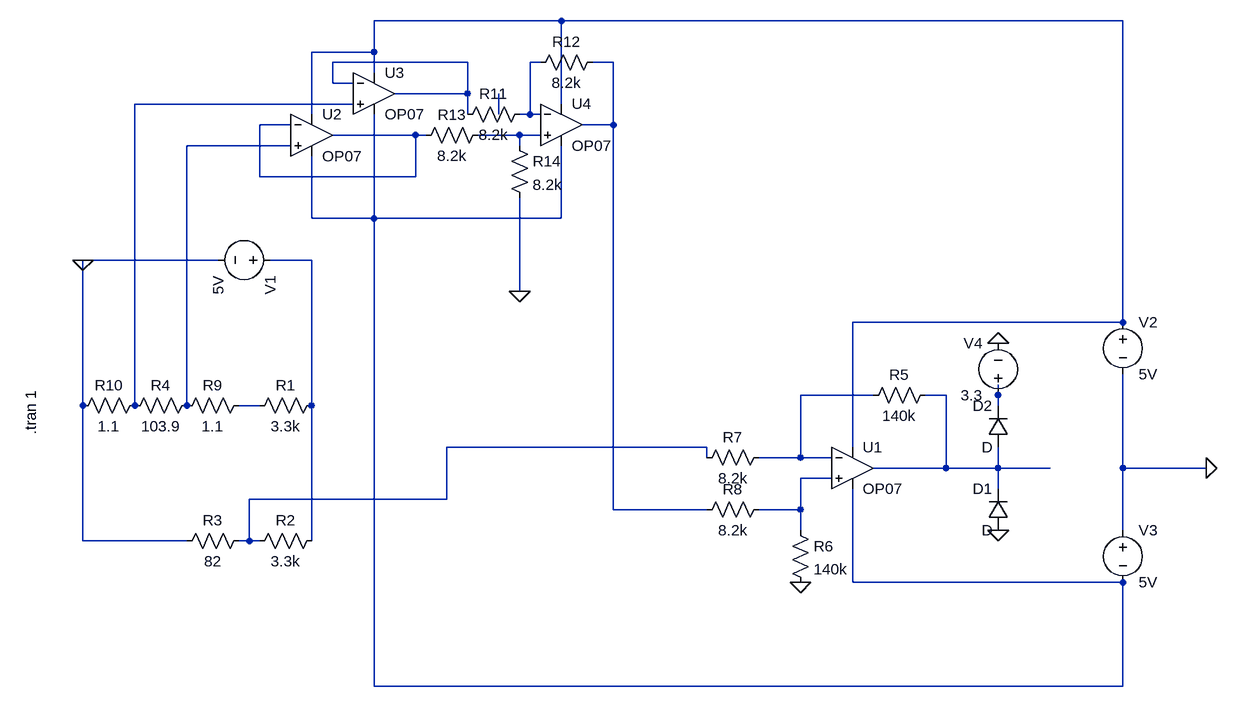
[diagram p0: schematic Draft1.asc]
Draft1.asc, the LTspice schematic file:
Version 4
SHEET 1 1332 680
WIRE 320 -832 32 -832
WIRE 1184 -832 320 -832
WIRE 32 -784 32 -832
WIRE 32 -784 -64 -784
WIRE 176 -768 -32 -768
WIRE 288 -768 272 -768
WIRE 400 -768 368 -768
WIRE 32 -752 32 -784
WIRE -32 -736 -32 -768
WIRE 0 -736 -32 -736
WIRE 176 -720 176 -768
WIRE 176 -720 64 -720
WIRE 0 -704 -336 -704
WIRE 320 -704 320 -832
WIRE -64 -688 -64 -784
WIRE 176 -688 176 -720
WIRE 224 -688 224 -720
WIRE 272 -688 272 -768
WIRE 272 -688 256 -688
WIRE 288 -688 272 -688
WIRE -96 -672 -144 -672
WIRE 400 -672 400 -768
WIRE 400 -672 352 -672
WIRE 96 -656 -32 -656
WIRE 112 -656 96 -656
WIRE 256 -656 192 -656
WIRE 288 -656 256 -656
WIRE -96 -640 -256 -640
WIRE 256 -640 256 -656
WIRE -144 -592 -144 -672
WIRE 96 -592 96 -656
WIRE 96 -592 -144 -592
WIRE -64 -528 -64 -624
WIRE 32 -528 32 -688
WIRE 32 -528 -64 -528
WIRE 320 -528 320 -640
WIRE 320 -528 32 -528
WIRE -208 -464 -416 -464
WIRE -64 -464 -128 -464
WIRE 256 -416 256 -560
WIRE 1184 -368 1184 -832
WIRE 1184 -368 768 -368
WIRE 800 -256 688 -256
WIRE 912 -256 880 -256
WIRE 992 -256 992 -272
WIRE -416 -240 -416 -464
WIRE -336 -240 -336 -704
WIRE -256 -240 -256 -640
WIRE -144 -240 -176 -240
WIRE -64 -240 -64 -464
WIRE 992 -240 992 -256
WIRE 544 -176 144 -176
WIRE 768 -176 768 -368
WIRE 544 -160 544 -176
WIRE 688 -160 688 -256
WIRE 688 -160 624 -160
WIRE 736 -160 688 -160
WIRE 912 -144 912 -256
WIRE 912 -144 800 -144
WIRE 992 -144 992 -176
WIRE 992 -144 912 -144
WIRE 1072 -144 992 -144
WIRE 1184 -144 1184 -288
WIRE 1312 -144 1184 -144
WIRE 736 -128 688 -128
WIRE 992 -112 992 -144
WIRE 144 -96 144 -176
WIRE 144 -96 -160 -96
WIRE 400 -80 400 -672
WIRE 544 -80 400 -80
WIRE 688 -80 688 -128
WIRE 688 -80 624 -80
WIRE 688 -48 688 -80
WIRE 1184 -48 1184 -144
WIRE -416 -32 -416 -240
WIRE -256 -32 -416 -32
WIRE -160 -32 -160 -96
WIRE -160 -32 -176 -32
WIRE -144 -32 -160 -32
WIRE -64 -32 -64 -240
WIRE 768 32 768 -112
WIRE 1184 32 768 32
WIRE 32 192 32 -528
WIRE 1184 192 1184 32
WIRE 1184 192 32 192
FLAG 688 32 0
FLAG 1312 -144 0
FLAG 992 -336 0
FLAG 992 -48 0
FLAG 256 -416 0
FLAG -416 -464 0
DATAFLAG 400 -512 ""
SYMBOL res -48 -256 R90
WINDOW 0 0 56 VBottom 2
WINDOW 3 32 56 VTop 2
SYMATTR InstName R1
SYMATTR Value 3.3k
SYMATTR SpiceLine tol=0.1
SYMBOL res -48 -48 R90
WINDOW 0 0 56 VBottom 2
WINDOW 3 32 56 VTop 2
SYMATTR InstName R2
SYMATTR Value 3.3k
SYMATTR SpiceLine tol=0.1
SYMBOL res -160 -48 R90
WINDOW 0 0 56 VBottom 2
WINDOW 3 32 56 VTop 2
SYMATTR InstName R3
SYMATTR Value 82
SYMATTR SpiceLine tol=0.1
SYMBOL voltage -112 -464 R90
WINDOW 123 0 0 Left 0
WINDOW 39 0 0 Left 0
SYMATTR InstName V1
SYMATTR Value 5V
SYMBOL OpAmps\\OP07 768 -208 R0
SYMATTR InstName U1
SYMBOL res 896 -272 R90
WINDOW 0 0 56 VBottom 2
WINDOW 3 32 56 VTop 2
SYMATTR InstName R5
SYMATTR Value 140k
SYMATTR SpiceLine tol=0.1
SYMBOL res 672 -64 R0
SYMATTR InstName R6
SYMATTR Value 140k
SYMATTR SpiceLine tol=0.1
SYMBOL res 640 -176 R90
WINDOW 0 0 56 VBottom 2
WINDOW 3 32 56 VTop 2
SYMATTR InstName R7
SYMATTR Value 8.2k
SYMATTR SpiceLine tol=0.1
SYMBOL res 640 -96 R90
WINDOW 0 0 56 VBottom 2
WINDOW 3 32 56 VTop 2
SYMATTR InstName R8
SYMATTR Value 8.2k
SYMATTR SpiceLine tol=0.1
SYMBOL voltage 1184 -384 R0
WINDOW 123 0 0 Left 0
WINDOW 39 0 0 Left 0
SYMATTR InstName V2
SYMATTR Value 5V
SYMBOL voltage 1184 -64 R0
WINDOW 123 0 0 Left 0
WINDOW 39 0 0 Left 0
SYMATTR InstName V3
SYMATTR Value 5V
SYMBOL diode 1008 -48 R180
WINDOW 0 24 64 Left 2
WINDOW 3 24 0 Left 2
SYMATTR InstName D1
SYMBOL diode 1008 -176 R180
WINDOW 0 24 64 Left 2
WINDOW 3 24 0 Left 2
SYMATTR InstName D2
SYMBOL voltage 992 -240 R180
WINDOW 0 24 96 Left 2
WINDOW 3 24 16 Left 2
WINDOW 123 0 0 Left 0
WINDOW 39 0 0 Left 0
SYMATTR InstName V4
SYMATTR Value 3.3
SYMBOL res -240 -256 R90
WINDOW 0 0 56 VBottom 2
WINDOW 3 32 56 VTop 2
SYMATTR InstName R4
SYMATTR Value 103.9
SYMATTR SpiceLine tol=0.1
SYMBOL res -160 -256 R90
WINDOW 0 0 56 VBottom 2
WINDOW 3 32 56 VTop 2
SYMATTR InstName R9
SYMATTR Value 1.1
SYMBOL res -320 -256 R90
WINDOW 0 0 56 VBottom 2
WINDOW 3 32 56 VTop 2
SYMATTR InstName R10
SYMATTR Value 1.1
SYMBOL OpAmps\\OP07 -64 -720 R0
SYMATTR InstName U2
SYMBOL OpAmps\\OP07 32 -784 R0
SYMATTR InstName U3
SYMBOL OpAmps\\OP07 320 -736 R0
SYMATTR InstName U4
SYMBOL res 272 -704 R90
WINDOW 0 0 56 VBottom 2
WINDOW 3 32 56 VTop 2
SYMATTR InstName R11
SYMATTR Value 8.2k
SYMBOL res 384 -784 R90
WINDOW 0 0 56 VBottom 2
WINDOW 3 32 56 VTop 2
SYMATTR InstName R12
SYMATTR Value 8.2k
SYMBOL res 208 -672 R90
WINDOW 0 0 56 VBottom 2
WINDOW 3 32 56 VTop 2
SYMATTR InstName R13
SYMATTR Value 8.2k
SYMBOL res 240 -656 R0
SYMATTR InstName R14
SYMATTR Value 8.2k
TEXT -496 -264 VRight 2 !.tran 1

The netlist it stands for:
* Draft1.asc
R1 N011 N015 3.3k tol=0.1
R2 N011 N016 3.3k tol=0.1
R3 N016 0 82 tol=0.1
V1 N011 0 5V
XU1 N017 N012 N001 N010 N013 LT1001  ; OP07, pins In+ In- V+ V- OUT
R5 N013 N012 140k tol=0.1
R6 N017 0 140k tol=0.1
R7 N012 N016 8.2k tol=0.1
R8 N017 N004 8.2k tol=0.1
V2 N001 0 5V
V3 0 N010 5V
D1 0 N013 D
D2 N013 N014 D
V4 N014 0 3.3
R4 N009 N005 103.9 tol=0.1
R9 N015 N009 1.1
R10 N005 0 1.1
XU2 N009 N007 N001 N010 N007 LT1001  ; OP07, pins In+ In- V+ V- OUT
XU3 N005 N002 N001 N010 N002 LT1001  ; OP07, pins In+ In- V+ V- OUT
XU4 N008 N003 N001 N010 N004 LT1001  ; OP07, pins In+ In- V+ V- OUT
R11 N003 N002 8.2k
R12 N004 N003 8.2k
R13 N008 N007 8.2k
R14 N008 0 8.2k
.model D D
.lib standard.dio
.tran 1
.lib LTC.lib
.backanno
.end